# EAGLE schematic connect (EAGLE 7.2.0)
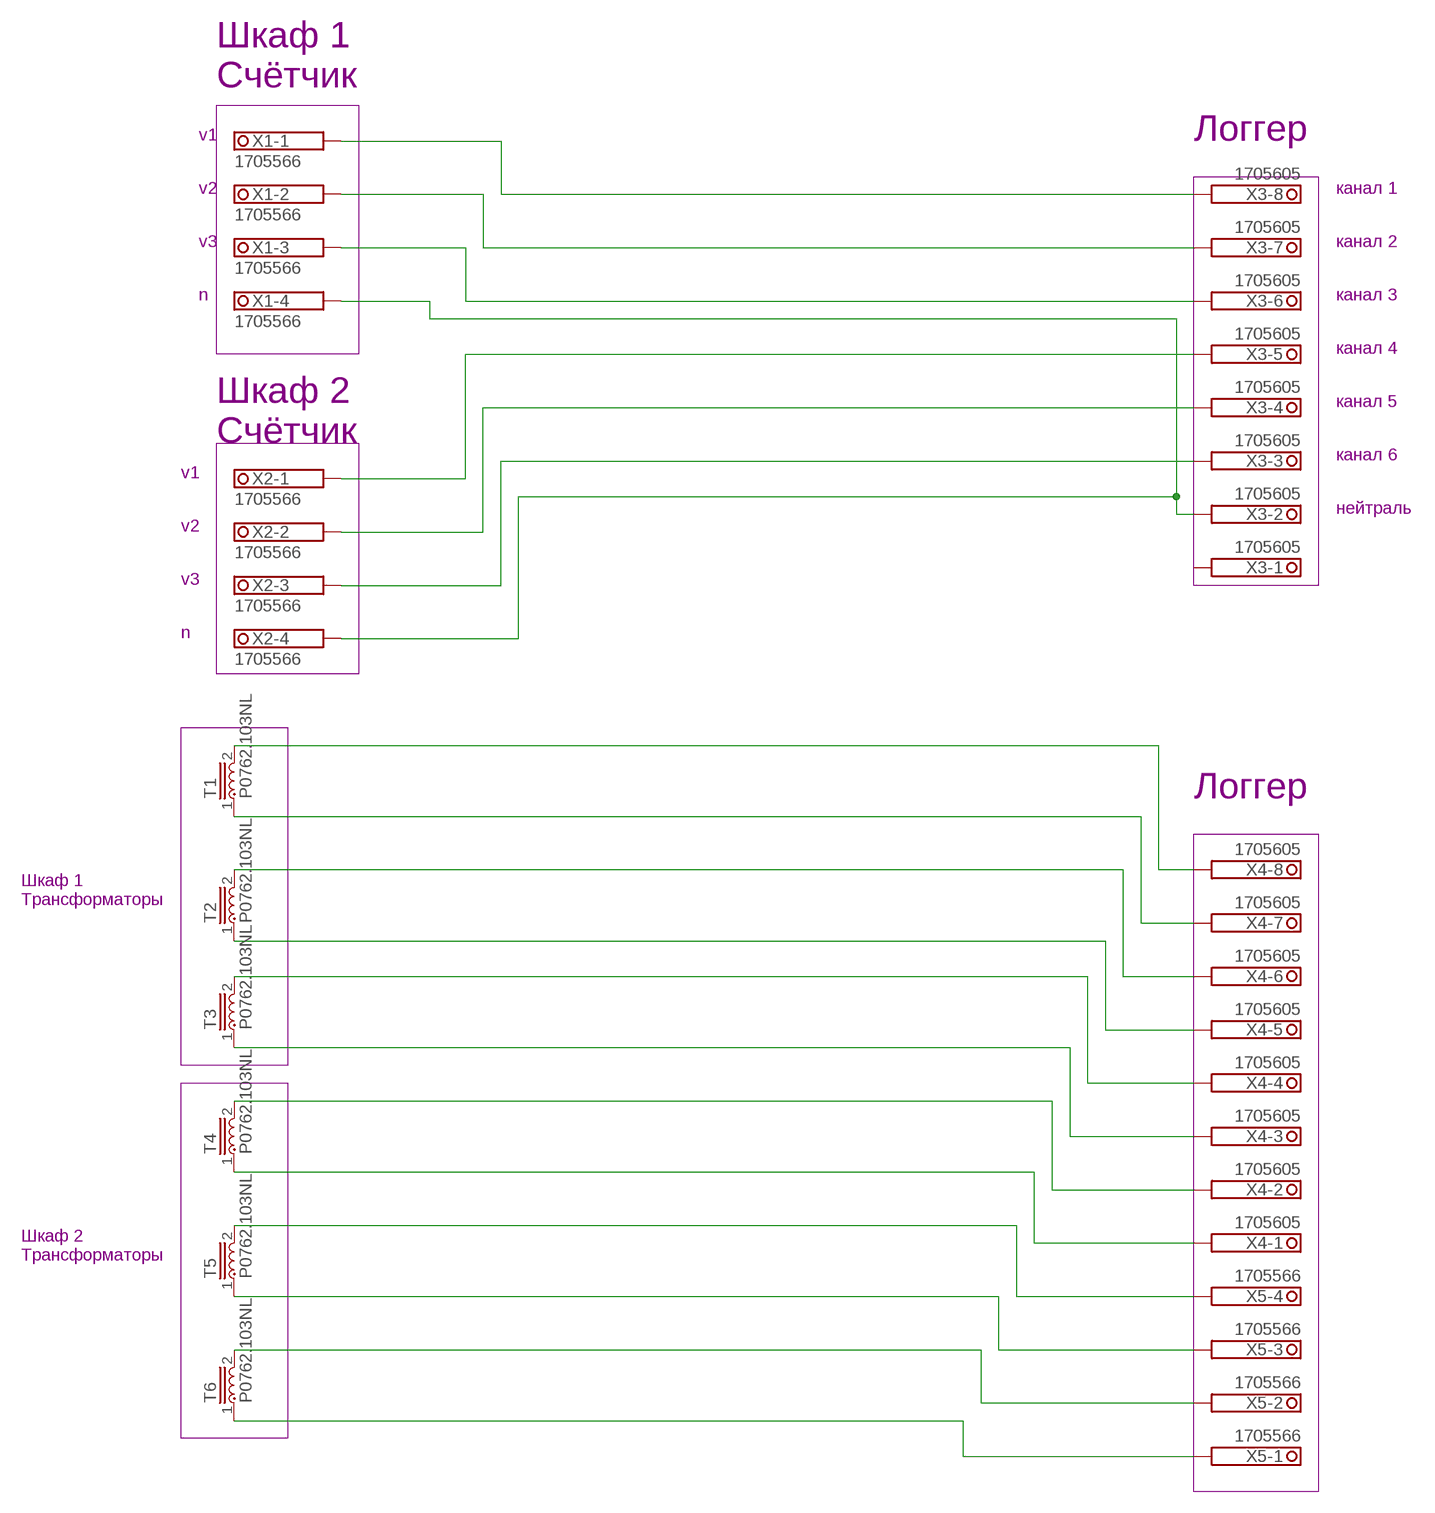
[diagram p0: schematic, sheet 1]

## Parts
T1  P0762.103NL  [P0762NL]
T2  P0762.103NL  [P0762NL]
T3  P0762.103NL  [P0762NL]
T4  P0762.103NL  [P0762NL]
T5  P0762.103NL  [P0762NL]
T6  P0762.103NL  [P0762NL]
X1  1705566  [1705566]
X2  1705566  [1705566]
X3  1705605  [1705605]
X4  1705605  [1705605]
X5  1705566  [1705566]

## Nets
N$1: X1.1.1 X1.1.2 X3.8.1 X3.8.2
N$2: X1.2.1 X1.2.2 X3.7.1 X3.7.2
N$3: X1.3.1 X1.3.2 X3.6.1 X3.6.2
N$4: X2.3.1 X2.3.2 X3.3.1 X3.3.2
N$5: X2.2.1 X2.2.2 X3.4.1 X3.4.2
N$6: X2.1.1 X2.1.2 X3.5.1 X3.5.2
N$7: X1.4.1 X1.4.2 X2.4.1 X2.4.2 X3.2.1 X3.2.2
N$8: T1.2 X4.8.1 X4.8.2
N$9: T1.1 X4.7.1 X4.7.2
N$10: T2.2 X4.6.1 X4.6.2
N$11: T2.1 X4.5.1 X4.5.2
N$12: T3.2 X4.4.1 X4.4.2
N$13: T3.1 X4.3.1 X4.3.2
N$14: T4.2 X4.2.1 X4.2.2
N$15: T4.1 X4.1.1 X4.1.2
N$16: T5.2 X5.4.1 X5.4.2
N$17: T5.1 X5.3.1 X5.3.2
N$18: T6.2 X5.2.1 X5.2.2
N$19: T6.1 X5.1.1 X5.1.2
Unconnected: X3.1.1 X3.1.2

## Notes on the sheet
- Шкаф 1
  Счётчик
- v1 | Логгер
- v2 | канал 1
- v3 | канал 2
- n | канал 3
- канал 4
- канал 5
- Шкаф 2
  Счётчик
- канал 6
- v1
- нейтраль
- v2
- v3
- n
- Логгер
- Шкаф 1
  Трансформаторы
- Шкаф 2
  Трансформаторы

## Library data of the parts
T1-T6 = inductors:P0762.*NL: Unshielded Drum Core P0762NL Series Source> http://ww2.pulseeng.com/products/datasheets/SPM2007.pdf
X1 X2 X5 = con-phoenix-3.81:1705566: MKDSD 1,5/ 4-3,81 Printklemme Nennstrom: 8 A Bemessungsspannung: 200 V Raster: 3,81 mm Polzahl: 4 Montageart: Löten Anschlussart: Schraubanschluss Anschlussrichtung vom Leiter zur Platine: 0° Source: http://eshop.phoenixcontact.com .. 1705566.pdf; OC_FARNELL: unknown; OC_NEWARK: unknown
X3 X4 = con-phoenix-3.81:1705605: MKDSD 1,5/10-3,81 Printklemme Nennstrom: 8 A Bemessungsspannung: 200 V Raster: 3,81 mm Polzahl: 12 Montageart: Löten Anschlussart: Schraubanschluss Anschlussrichtung vom Leiter zur Platine: 0° Source: http://eshop.phoenixcontact.com .. 1705605.pdf; OC_FARNELL: unknown; OC_NEWARK: unknown